# EAGLE design Main (EAGLE 9.6.2)
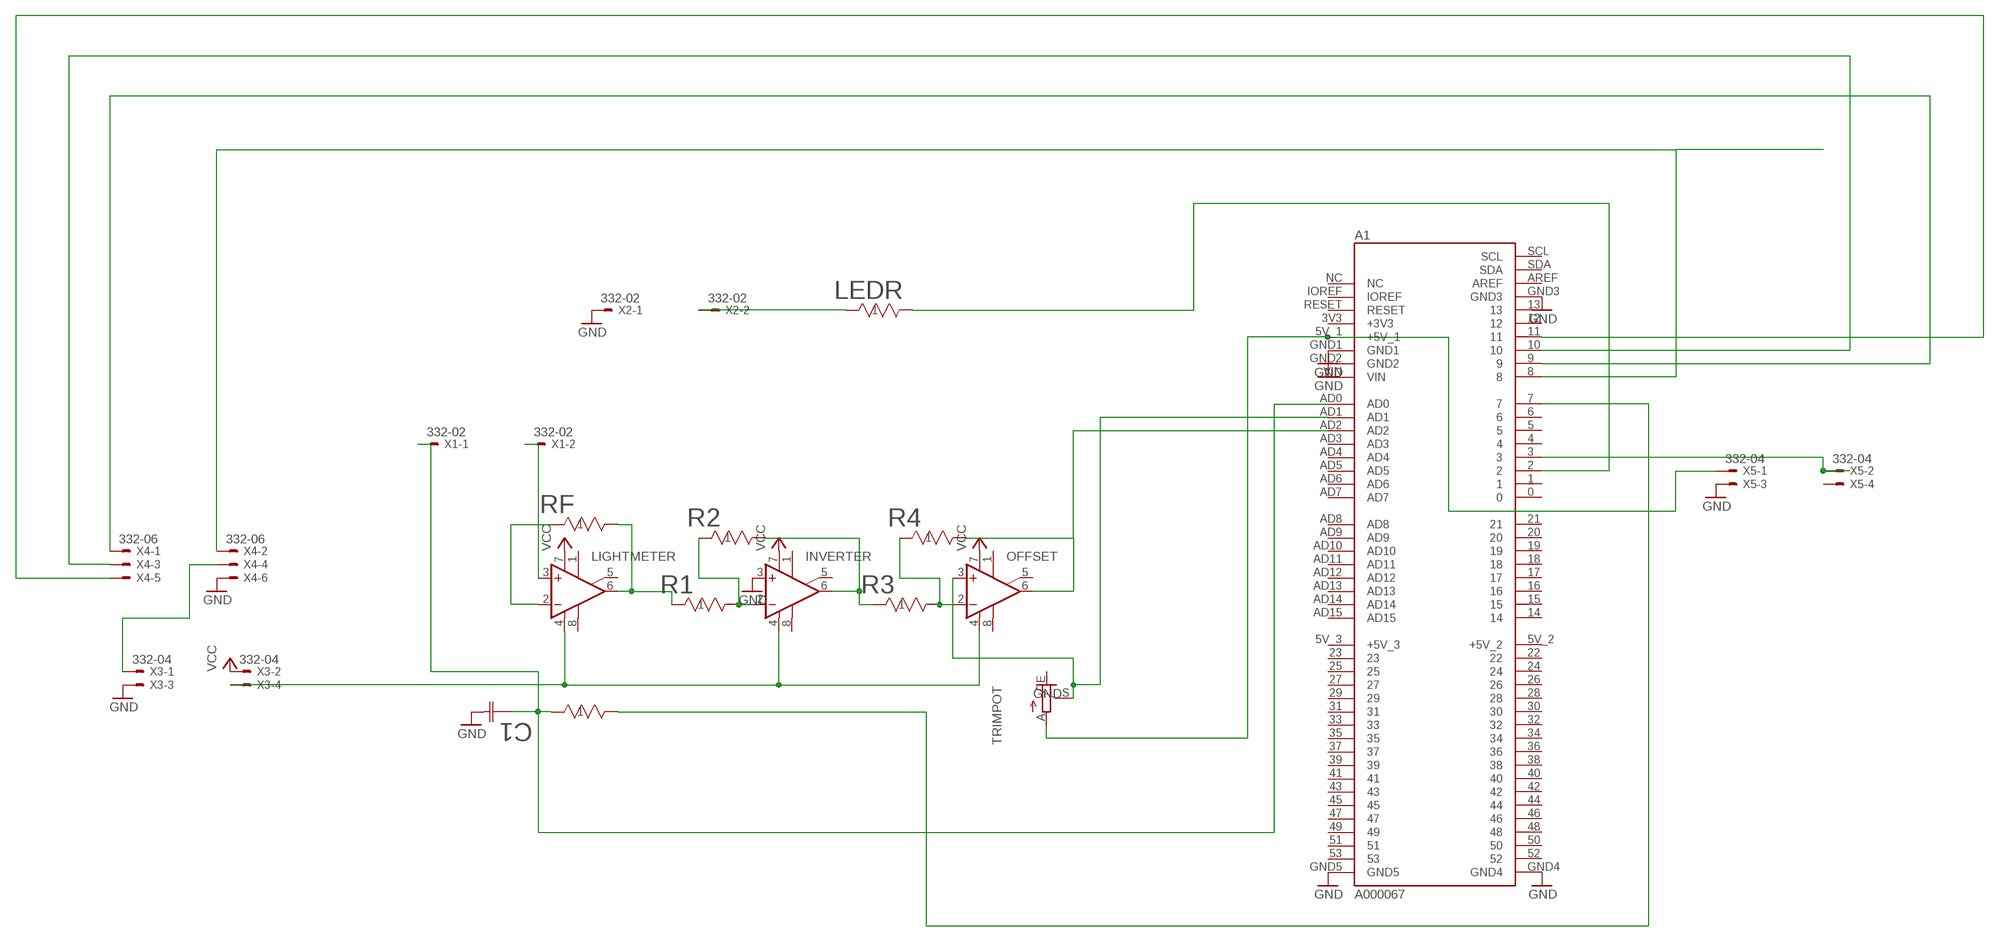
[diagram p0: schematic, sheet 1]

## Parts
A1  A000067  [ARDUINO_A000067]
C1  50YXF470MEFCG412.5X20  [CAP_YX_12P5X20_RUB]
INVERTER  LM741P  [DIL08]
LEDR  RNF14FTD47K0  [STA_RNF14_STP]
LIGHTMETER  LM741P  [DIL08]
OFFSET  LM741P  [DIL08]
R1  RNF14FTD47K0  [STA_RNF14_STP]
R2  RNF14FTD47K0  [STA_RNF14_STP]
R3  RNF14FTD47K0  [STA_RNF14_STP]
R4  RNF14FTD47K0  [STA_RNF14_STP]
RCR  RNF14FTD47K0  [STA_RNF14_STP]
RF  RNF14FTD47K0  [STA_RNF14_STP]
TRIMPOT  TRIM_EU-B25V  [B25V]
X1  332-02  [332-02]
X2  332-02  [332-02]
X3  332-04  [332-04]
X4  332-06  [332-06]
X5  332-04  [332-04]

## Nets
GND: A1.GND1 A1.GND2 A1.GND3 A1.GND4 A1.GND5 C1.2 INVERTER.3(+IN) TRIMPOT.E X2.1 X3.3 X4.6 X5.3
N$1: A1.AD1 OFFSET.3(+IN) TRIMPOT.S
N$2: A1.AD0 C1.1 RCR.1 X1.1
N$3: LIGHTMETER.2(-IN) RF.1
N$4: LIGHTMETER.6(OUT) R1.1 RF.2
N$5: INVERTER.2(-IN) R1.2 R2.1
N$6: A1.5V_1(+5V_1) TRIMPOT.A X5.1
N$7: INVERTER.6(OUT) R2.2 R3.1
N$8: OFFSET.2(-IN) R3.2 R4.1
N$9: INVERTER.4(V-) LIGHTMETER.4(V-) OFFSET.4(V-) X3.4
N$10: A1.AD2 OFFSET.6(OUT) R4.2
N$11: LIGHTMETER.3(+IN) X1.2
N$13: A1.7 RCR.2
N$14: A1.2 LEDR.2
N$15: LEDR.1 X2.2
N$16: X3.1 X4.4
N$17: A1.8 X4.2
N$18: A1.9 X4.1
N$19: A1.10 X4.3
N$20: A1.11 X4.5
N$21: A1.3 X5.2
VCC: INVERTER.7(V+) LIGHTMETER.7(V+) OFFSET.7(V+) X3.2
Unconnected: A1.0 A1.1 A1.3V3(+3V3) A1.4 A1.5 A1.5V_2(+5V_2) A1.5V_3(+5V_3) A1.6 A1.12 A1.13 A1.14 A1.15 A1.16 A1.17 A1.18 A1.19 A1.20 A1.21 A1.22 A1.23 A1.24 A1.25 A1.26 A1.27 A1.28 A1.29 A1.30 A1.31 A1.32 A1.33 A1.34 A1.35 A1.36 A1.37 A1.38 A1.39 A1.40 A1.41 A1.42 A1.43 A1.44 A1.45 A1.46 A1.47 A1.48 A1.49 A1.50 A1.51 A1.52 A1.53 A1.AD3 A1.AD4 A1.AD5 A1.AD6 A1.AD7 A1.AD8 A1.AD9 A1.AD10 A1.AD11 A1.AD12 A1.AD13 A1.AD14 A1.AD15 A1.AREF A1.IOREF A1.NC A1.RESET A1.SCL A1.SDA A1.VIN INVERTER.1(ON1) INVERTER.5(ON2) INVERTER.8(OPT) LIGHTMETER.1(ON1) LIGHTMETER.5(ON2) LIGHTMETER.8(OPT) OFFSET.1(ON1) OFFSET.5(ON2) OFFSET.8(OPT) X5.4

## Library data of the parts
A1 = A000067:A000067: ARDUINO UNO REV3 DEVELOPMENT BOARD; DESCRIPTION: Arduino Mega 2560 Rev3. ATmega2560 Microcontroller Mega Development Board 16MHz CPU 8KB RAM 4KB/256KB EEPROM/Flash; DIGI-KEY_PART_NUMBER: 1050-1018-ND; MF: Arduino; MP: A000067; PACKAGE: Non-Standard Arduino; PURCHASE-URL: https://pricing.snapeda.com/search/part/A000067/?ref=eda
C1 = electroliticCap470:50YXF470MEFCG412.5X20; COPYRIGHT: Copyright (C) 2022 Ultra Librarian. All rights reserved.; DIGI-KEY_PART_NUMBER_1: 1189-3768-1-ND; DIGI-KEY_PART_NUMBER_2: 1189-3768-3-ND; MANUFACTURER_PART_NUMBER: 50YXF470MEFCG412.5X20; MFR_NAME: Rubycon
INVERTER LIGHTMETER OFFSET = linear:*741: OP AMP
LEDR R1-R4 RCR RF = resistors:RNF14FTD47K0; COPYRIGHT: Copyright (C) 2022 Ultra Librarian. All rights reserved.; DIGI-KEY_PART_NUMBER_1: RNF14FTD47K0CT-ND; DIGI-KEY_PART_NUMBER_2: RNF14FTD47K0TR-ND; MANUFACTURER_PART_NUMBER: RNF14FTD47K0; MFR_NAME: Stackpole International
TRIMPOT = pot:TRIM_EU-: POTENTIOMETER
X1 X2 = con-garry:332-02: 2 Pin - 2mm Dual Row Source: www.mpe-connector.de / garry_shortform_2012.pdf
X3 X5 = con-garry:332-04: 4 Pin - 2mm Dual Row Source: www.mpe-connector.de / garry_shortform_2012.pdf
X4 = con-garry:332-06: 6 Pin - 2mm Dual Row Source: www.mpe-connector.de / garry_shortform_2012.pdf

## Module GND
Ports: 

### Library data of the parts

## Board
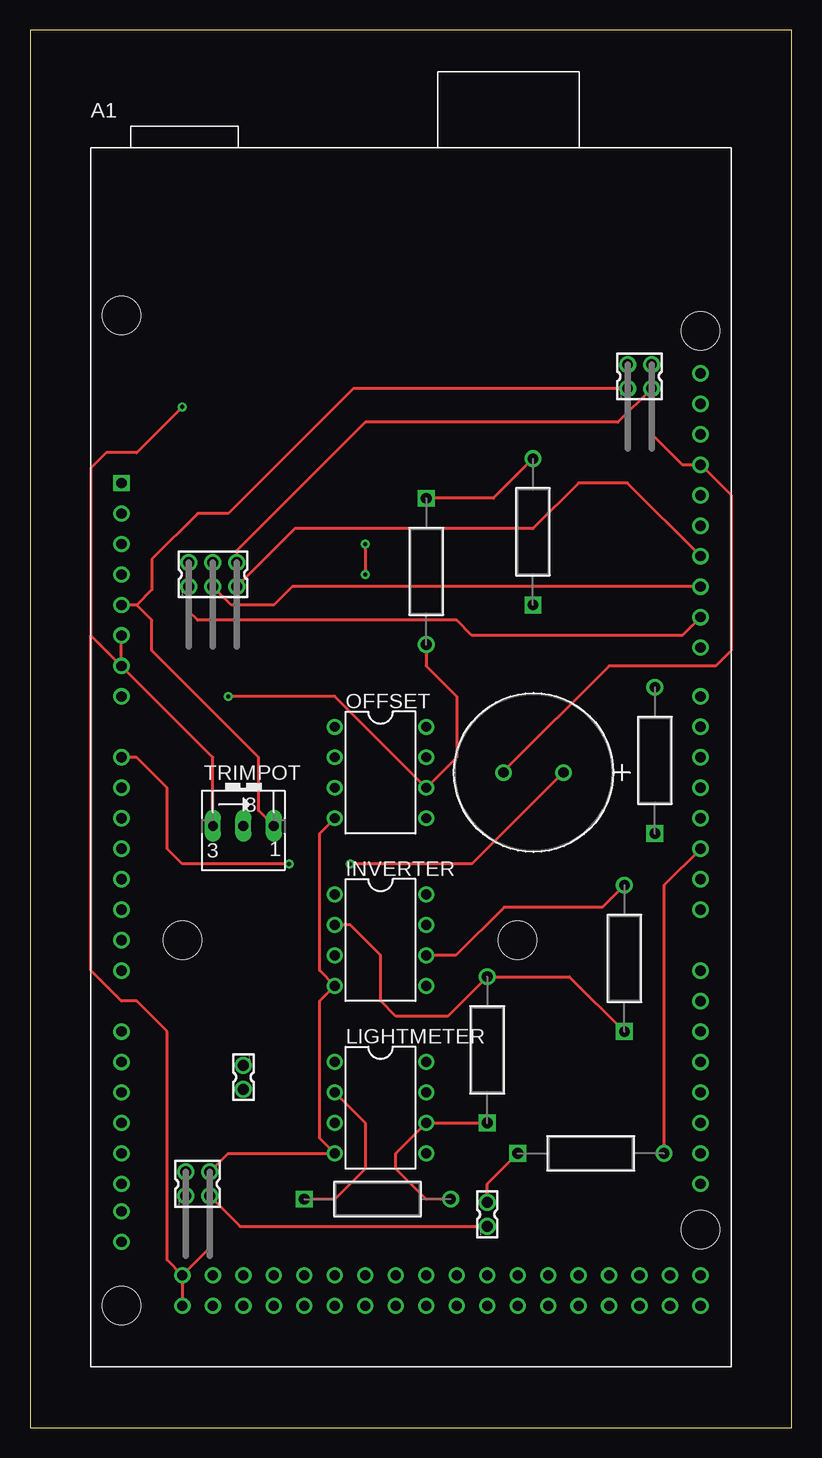
[diagram p1: board, top side]
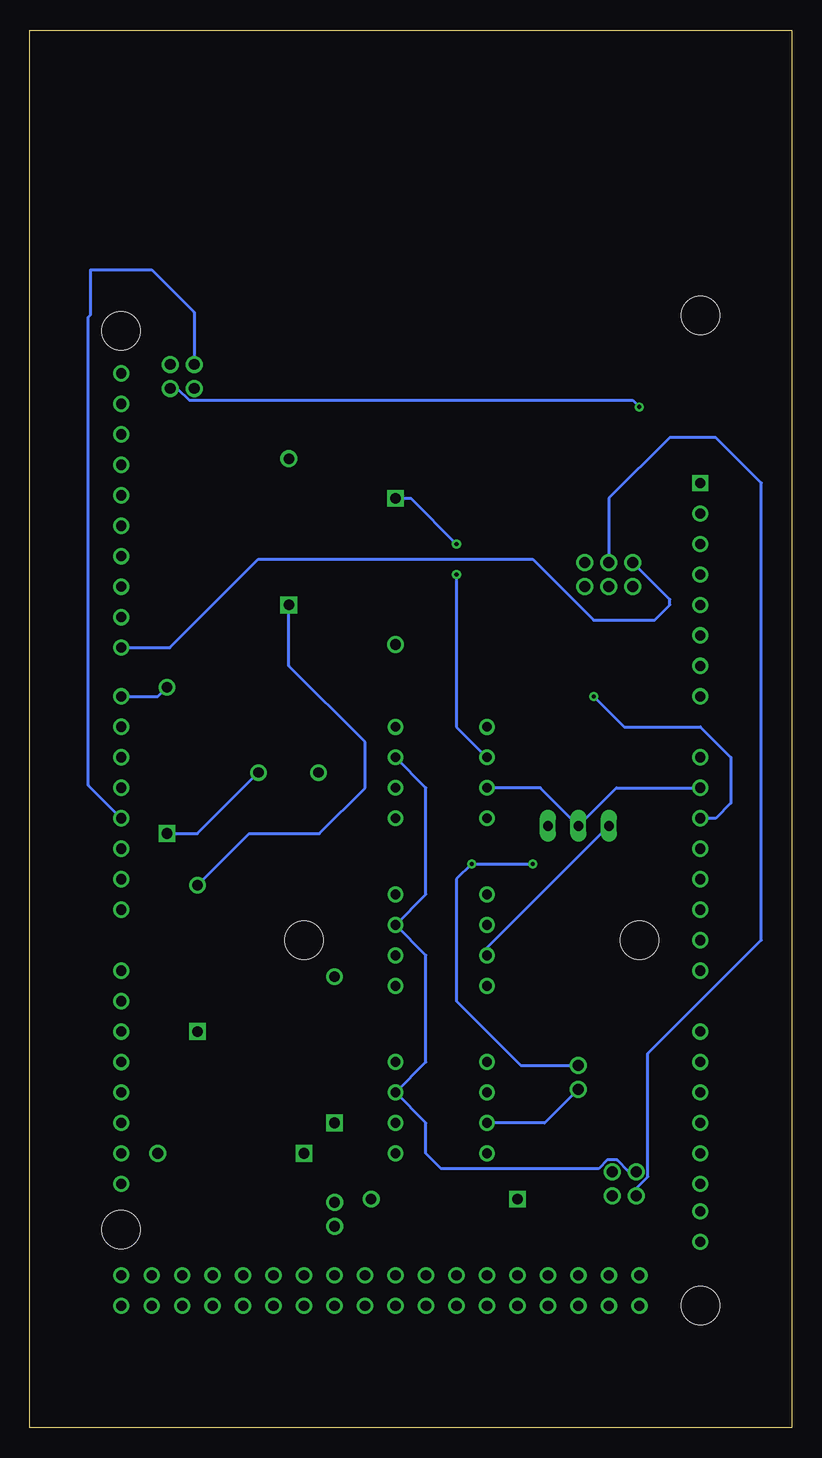
[diagram p2: board, bottom side, seen from below]

Size 63.48 x 116.51 mm. Coordinates in mm from the lower left corner, seen from the top.
Outline: 0,0 63.48,0 63.48,116.51 0,116.51 0,0
Copper layers (1*16): Top 0.035mm / dielectric 1.5mm / Bottom 0.035mm
Design rules "default": minimum track width 6mil, minimum drill 0.35mm, track to track 6mil, track to pad 6mil, pad to pad 6mil, via to via 6mil, smd to smd 6mil, copper to edge 40mil, drill to drill 6mil, minimum pad ring 10mil, minimum via ring 8mil, stop-mask expansion 4mil, vias tented up to drill 0mil, thermal gap 10mil

### Footprints (pad centres in the part's own frame; a part is rotated, then mirrored left to right if it is on the bottom)
ARDUINO_A000067 = drill 0.85: 0 24.13,-12.7; 1 24.13,-10.16; 2 24.13,-7.62; 3 24.13,-5.08; 3V3 -24.13,15.24; 4 24.13,-2.54; 5 24.13,0; 5V_1 -24.13,12.7; 5V_2 24.13,-43.18; 5V_3 24.13,-45.72; 6 24.13,2.54; 7 24.13,5.08; 8 24.13,9.144; 9 24.13,11.684; 10 24.13,14.224; 11 24.13,16.764; 12 24.13,19.304; 13 24.13,21.844; 14 24.13,-17.78; 15 24.13,-20.32; 16 24.13,-22.86; 17 24.13,-25.4; 18 24.13,-27.94; 19 24.13,-30.48; 20 24.13,-33.02; 21 24.13,-35.56; 22 21.59,-43.18; 23 21.59,-45.72; 24 19.05,-43.18; 25 19.05,-45.72; 26 16.51,-43.18; 27 16.51,-45.72; 28 13.97,-43.18; 29 13.97,-45.72; 30 11.43,-43.18; 31 11.43,-45.72; 32 8.89,-43.18; 33 8.89,-45.72; 34 6.35,-43.18; 35 6.35,-45.72; 36 3.81,-43.18; 37 3.81,-45.72; 38 1.27,-43.18; 39 1.27,-45.72; 40 -1.27,-43.18; 41 -1.27,-45.72; 42 -3.81,-43.18; 43 -3.81,-45.72; 44 -6.35,-43.18; 45 -6.35,-45.72; 46 -8.89,-43.18; 47 -8.89,-45.72; 48 -11.43,-43.18; 49 -11.43,-45.72; 50 -13.97,-43.18; 51 -13.97,-45.72; 52 -16.51,-43.18; 53 -16.51,-45.72; AD0 -24.13,0; AD1 -24.13,-2.54; AD2 -24.13,-5.08; AD3 -24.13,-7.62; AD4 -24.13,-10.16; AD5 -24.13,-12.7; AD6 -24.13,-15.24; AD7 -24.13,-17.78; AD8 -24.13,-22.86; AD9 -24.13,-25.4; AD10 -24.13,-27.94; AD11 -24.13,-30.48; AD12 -24.13,-33.02; AD13 -24.13,-35.56; AD14 -24.13,-37.846; AD15 -24.13,-40.386; AREF 24.13,26.924; GND1 -24.13,10.16; GND2 -24.13,7.62; GND3 24.13,24.384; GND4 -19.05,-43.18; GND5 -19.05,-45.72; IOREF -24.13,20.32; RESET -24.13,17.78; SCL 24.13,32.004; SDA 24.13,29.464; VIN -24.13,5.08 | drill 0.85 square: NC -24.13,22.86 | hole 3.2: -24.13,36.83; -19.05,-15.24; 8.89,-15.24; 24.13,35.56; -24.13,-45.72; 24.13,-39.37
CAP_YX_12P5X20_RUB = drill 0.864 pad 1.372: 1 0,0; 2 5.004,0
DIL08 = drill 0.813 pad 1.27: 1 -3.81,-3.81; 2 -1.27,-3.81; 3 1.27,-3.81; 4 3.81,-3.81; 5 3.81,3.81; 6 1.27,3.81; 7 -1.27,3.81; 8 -3.81,3.81
STA_RNF14_STP = drill 0.889 pad 1.397 square: 1 0,0 | drill 0.889 pad 1.397: 2 12.192,0
B25V = drill 0.813 long: A 2.54,0.635; E -2.54,0.635; S 0,0.635
332-02 = drill 0.9 pad 1.27: 1 0,-1; 2 0,1
332-04 = drill 0.9 pad 1.27: 1 -1,-1; 2 -1,1; 3 1,-1; 4 1,1
332-06 = drill 0.9 pad 1.27: 1 -2,-1; 2 -2,1; 3 0,-1; 4 0,1; 5 2,-1; 6 2,1

### Placement (x,y rotation side)
A1  31.75,55.88 0 top
C1  44.45,54.61 180 top
INVERTER  29.21,40.64 270 top
LEDR  40.64,22.86 0 top
LIGHTMETER  29.21,26.67 270 top
OFFSET  29.21,54.61 270 top
R1  38.1,25.4 90 top
R2  49.53,33.02 90 top
R3  41.91,68.58 90 top
R4  33.02,77.47 270 top
RCR  52.07,49.53 90 top
RF  22.86,19.05 0 top
TRIMPOT  17.78,49.53 0 top
X1  17.78,29.21 180 top
X2  38.1,17.78 0 top
X3  13.97,20.32 0 top
X4  15.24,71.12 0 top
X5  50.8,87.63 0 top

### Tracks (layer width: path | path; a pad name or v marks a point on that pad's centre or on a via)
GND  (via drill 0.35)
  Top 0.254: TRIMPOT.E 15.24,55.88 A1.GND2 | A1.GND2 A1.GND1 | X4.6 17.24,73.12 27.94,83.82 48.99,83.82 X5.3 51.8,82.82 54.36,80.26 A1.GND3 58.42,77.72 58.42,64.77 57.15,63.5 48.26,63.5 39.45,54.69 C1.2 | A1.GND4 14.97,14.97 X3.3 17.51,16.78 X2.1 | A1.GND4 A1.GND5 | v12.7,85.09 8.89,81.28 6.35,81.28 5.08,80.01 5.08,66.04 | 5.08,66.04 A1.GND2 | A1.GND4 11.43,13.97 11.43,33.02 8.89,35.56 7.62,35.56 5.08,38.1 5.08,66.04
  Bottom 0.254: TRIMPOT.E 25.4,40.01 INVERTER.3 | X5.3 51.19,86.63 50.21,85.65 13.26,85.65 v12.7,85.09
N$1
  Bottom 0.254: OFFSET.3 20.95,53.34 TRIMPOT.S 14.61,53.34 A1.AD1
N$2  (via drill 0.35)
  Top 0.254: C1.1 36.83,46.99 v26.67,46.99 | v21.59,46.99 12.7,46.99 11.43,48.26 11.43,53.34 8.89,55.88 A1.AD0
  Bottom 0.254: RCR.1 49.53,49.53 C1.1 | X1.1 22.59,30.21 27.94,35.56 27.94,45.72 v26.67,46.99 v21.59,46.99
N$3
  Top 0.254: LIGHTMETER.2 27.94,25.4 27.94,21.59 25.4,19.05 RF.1
N$4
  Top 0.254: RF.2 33.02,19.05 30.48,21.59 30.48,22.86 LIGHTMETER.6 R1.1
N$5
  Top 0.254: R2.1 44.96,37.59 R1.2 34.8,34.29 30.48,34.29 29.21,35.56 29.21,39.37 26.67,41.91 INVERTER.2
N$6
  Top 0.254: X5.1 26.94,86.63 16.51,76.2 13.97,76.2 10.16,72.39 10.16,69.85 8.89,68.58 | TRIMPOT.A 19.05,51.44 19.05,55.88 10.16,64.77 10.16,67.31 8.89,68.58 | 8.89,68.58 A1.5V_1
N$7
  Top 0.254: INVERTER.6 35.49,39.37 39.5,43.38 47.7,43.38 R2.2
  Bottom 0.254: R2.2 45.21,49.53 39.37,49.53 35.56,53.34 35.56,57.15 41.91,63.5 R3.1
N$8  (via drill 0.35)
  Top 0.254: R3.2 38.61,77.47 R4.1 | v27.94,73.66 v27.94,71.12
  Bottom 0.254: R4.1 31.75,77.47 v27.94,73.66 | v27.94,71.12 27.94,58.42 OFFSET.2
N$9
  Top 0.254: X3.4 16.51,22.86 LIGHTMETER.4 24.13,24.13 24.13,35.56 INVERTER.4 24.13,38.1 24.13,49.53 OFFSET.4
N$10  (via drill 0.35)
  Top 0.254: R4.2 33.02,63.5 35.56,60.96 35.56,55.88 OFFSET.6 25.4,60.96 v16.51,60.96
  Bottom 0.254: v16.51,60.96 13.97,58.42 7.62,58.42 5.08,55.88 5.08,52.07 6.35,50.8 A1.AD2
N$11
  Bottom 0.254: X1.2 20.59,25.4 LIGHTMETER.3
N$13
  Bottom 0.254: A1.7 52.83,60.96 RCR.2
N$14
  Top 0.254: A1.2 52.83,45.21 LEDR.2
N$15
  Top 0.254: X2.2 38.1,20.32 LEDR.1
N$16
  Bottom 0.254: X3.1 12.97,19.93 11.99,20.91 11.99,31.19 2.54,40.64 2.54,78.74 6.35,82.55 10.16,82.55 15.24,77.47 X4.4
N$17
  Bottom 0.254: A1.8 51.82,65.02 44.45,72.39 21.59,72.39 16.51,67.31 11.43,67.31 10.16,68.58 10.16,69.04 X4.2
N$18
  Top 0.254: A1.9 54.36,66.04 36.83,66.04 35.56,67.31 13.97,67.31 13.24,68.04 X4.1
N$19
  Top 0.254: A1.10 21.84,70.1 20.32,68.58 16.78,68.58 X4.3
N$20
  Top 0.254: A1.11 49.78,78.74 45.72,78.74 41.91,74.93 22.05,74.93 X4.5
N$21
  Bottom 0.254: X5.2 49.8,92.98 53.34,96.52 58.42,96.52 58.42,92.78 58.62,92.58 58.62,53.54 A1.3
VCC
  Bottom 0.254: X3.2 13.58,21.32 14.56,22.3 15.38,22.3 16.09,21.59 29.21,21.59 30.48,22.86 30.48,25.4 LIGHTMETER.7 30.48,30.48 30.48,39.37 INVERTER.7 30.48,44.45 30.48,53.34 OFFSET.7